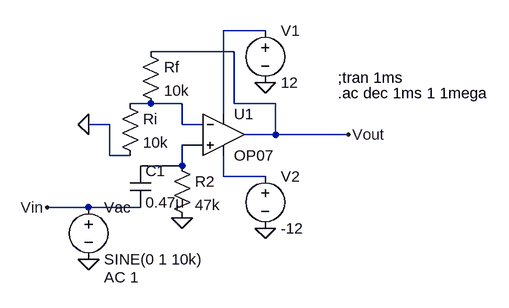
[diagram p0: schematic nonInvertingAmplifier.asc]
nonInvertingAmplifier.asc, the LTspice schematic file:
Version 4
SHEET 1 880 680
WIRE 240 16 176 16
WIRE 192 48 64 48
WIRE 64 128 32 128
WIRE 112 128 64 128
WIRE 192 128 192 48
WIRE 256 128 192 128
WIRE 176 144 176 16
WIRE 0 160 -32 160
WIRE 112 160 112 128
WIRE 144 160 112 160
WIRE 256 176 256 128
WIRE 256 176 208 176
WIRE 368 176 256 176
WIRE 144 192 112 192
WIRE 0 208 0 160
WIRE 32 208 0 208
WIRE 112 224 112 192
WIRE 112 224 48 224
WIRE 176 240 176 208
WIRE 240 240 176 240
WIRE -32 288 -96 288
WIRE 48 288 -32 288
FLAG -32 160 0
FLAG 112 304 0
FLAG -32 368 0
FLAG 240 320 0
FLAG 240 96 0
FLAG 368 176 Vout
FLAG -96 288 Vin
SYMBOL OpAmps\\OP07 176 112 R0
SYMATTR InstName U1
SYMBOL res 16 112 R0
SYMATTR InstName Ri
SYMATTR Value 10k
SYMBOL res 96 208 R0
SYMATTR InstName R2
SYMATTR Value 47k
SYMBOL cap 32 224 R0
SYMATTR InstName C1
SYMATTR Value 0.47μ
SYMBOL voltage -32 272 R0
WINDOW 123 24 124 Left 2
WINDOW 39 0 0 Left 0
SYMATTR InstName Vac
SYMATTR Value SINE(0 1 10k)
SYMATTR Value2 AC 1
SYMBOL voltage 240 224 R0
WINDOW 123 0 0 Left 0
WINDOW 39 0 0 Left 0
SYMATTR InstName V2
SYMATTR Value -12
SYMBOL voltage 240 0 R0
WINDOW 123 0 0 Left 0
WINDOW 39 0 0 Left 0
SYMATTR InstName V1
SYMATTR Value 12
SYMBOL res 48 32 R0
SYMATTR InstName Rf
SYMATTR Value 10k
TEXT 352 88 Left 2 !;tran 1ms
TEXT 352 112 Left 2 !.ac dec 1ms 1 1mega

The netlist it stands for:
* nonInvertingAmplifier.asc
XU1 N003 N002 N001 N004 Vout LT1001  ; OP07, pins In+ In- V+ V- OUT
Ri N002 0 10k
R2 N003 0 47k
C1 N003 Vin 0.47μ
Vac Vin 0 SINE(0 1 10k) AC 1
V2 N004 0 -12
V1 N001 0 12
Rf Vout N002 10k
;tran 1ms
.ac dec 1ms 1 1mega
.lib LTC.lib
.backanno
.end